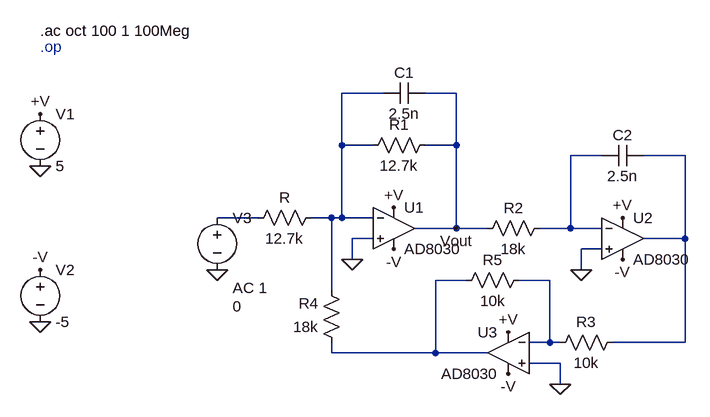
[diagram p0: schematic Stage2.asc]
Stage2.asc, the LTspice schematic file:
Version 4
SHEET 1 1212 680
WIRE 592 -144 528 -144
WIRE 704 -144 656 -144
WIRE 528 -64 528 -144
WIRE 576 -64 528 -64
WIRE 704 -64 704 -144
WIRE 704 -64 656 -64
WIRE 928 -48 880 -48
WIRE 1056 -48 992 -48
WIRE 400 48 336 48
WIRE 512 48 480 48
WIRE 528 48 528 -64
WIRE 528 48 512 48
WIRE 576 48 528 48
WIRE 704 64 704 -64
WIRE 704 64 640 64
WIRE 752 64 704 64
WIRE 880 64 880 -48
WIRE 880 64 832 64
WIRE 928 64 880 64
WIRE 576 80 544 80
WIRE 1056 80 1056 -48
WIRE 1056 80 992 80
WIRE 928 96 896 96
WIRE 544 112 544 80
WIRE 896 128 896 96
WIRE 720 144 672 144
WIRE 848 144 800 144
WIRE 512 160 512 48
WIRE 848 240 848 144
WIRE 848 240 816 240
WIRE 864 240 848 240
WIRE 1056 240 1056 80
WIRE 1056 240 944 240
WIRE 512 256 512 240
WIRE 672 256 672 144
WIRE 672 256 512 256
WIRE 752 256 672 256
WIRE 864 272 816 272
WIRE 864 304 864 272
FLAG 64 -32 0
FLAG 64 208 0
FLAG 64 -112 +V
FLAG 64 128 -V
FLAG 704 64 Vout
FLAG 544 112 0
FLAG 864 304 0
FLAG 896 128 0
FLAG 608 32 +V
FLAG 960 48 +V
FLAG 784 224 +V
FLAG 608 96 -V
FLAG 784 288 -V
FLAG 960 112 -V
FLAG 336 128 0
SYMBOL voltage 64 -128 R0
SYMATTR InstName V1
SYMATTR Value 5
SYMBOL voltage 64 112 R0
SYMATTR InstName V2
SYMATTR Value -5
SYMBOL res 672 -80 R90
WINDOW 0 0 56 VBottom 2
WINDOW 3 32 56 VTop 2
SYMATTR InstName R1
SYMATTR Value 12.7k
SYMBOL res 848 48 R90
WINDOW 0 0 56 VBottom 2
WINDOW 3 32 56 VTop 2
SYMATTR InstName R2
SYMATTR Value 18k
SYMBOL res 960 224 R90
WINDOW 0 0 56 VBottom 2
WINDOW 3 32 56 VTop 2
SYMATTR InstName R3
SYMATTR Value 10k
SYMBOL res 496 32 R90
WINDOW 0 0 56 VBottom 2
WINDOW 3 32 56 VTop 2
SYMATTR InstName R
SYMATTR Value 12.7k
SYMBOL res 528 256 R180
WINDOW 0 36 76 Left 2
WINDOW 3 36 40 Left 2
SYMATTR InstName R4
SYMATTR Value 18k
SYMBOL cap 656 -160 R90
WINDOW 0 0 32 VBottom 2
WINDOW 3 32 32 VTop 2
SYMATTR InstName C1
SYMATTR Value 2.5n
SYMBOL cap 992 -64 R90
WINDOW 0 0 32 VBottom 2
WINDOW 3 32 32 VTop 2
SYMATTR InstName C2
SYMATTR Value 2.5n
SYMBOL res 816 128 R90
WINDOW 0 0 56 VBottom 2
WINDOW 3 32 56 VTop 2
SYMATTR InstName R5
SYMATTR Value 10k
SYMBOL voltage 336 32 R0
WINDOW 3 24 152 Left 2
WINDOW 123 24 124 Left 2
WINDOW 39 0 0 Left 0
SYMATTR Value 0
SYMATTR Value2 AC 1
SYMATTR InstName V3
SYMBOL OpAmps\\AD8030 608 0 R0
SYMATTR InstName U1
SYMBOL OpAmps\\AD8030 960 16 R0
SYMATTR InstName U2
SYMBOL OpAmps\\AD8030 784 192 M0
SYMATTR InstName U3
TEXT 64 -240 Left 2 !.ac oct 100 1 100Meg
TEXT 64 -216 Left 2 ;.op

The netlist it stands for:
* Stage2.asc
V1 +V 0 5
V2 -V 0 -5
R1 Vout N001 12.7k
R2 N002 Vout 18k
R3 N003 N006 10k
R N001 N004 12.7k
R4 N005 N001 18k
C1 Vout N001 2.5n
C2 N003 N002 2.5n
R5 N006 N005 10k
V3 N004 0 0 AC 1
XU1 0 N001 +V -V Vout AD8040  ; AD8030, pins In+ In- V+ V- OUT
XU2 0 N002 +V -V N003 AD8040  ; AD8030, pins In+ In- V+ V- OUT
XU3 0 N006 +V -V N005 AD8040  ; AD8030, pins In+ In- V+ V- OUT
.ac oct 100 1 100Meg
* .op
.lib ADI.lib
.backanno
.end